# Altium project Power_Board_Schematics_v1.PrjPcb
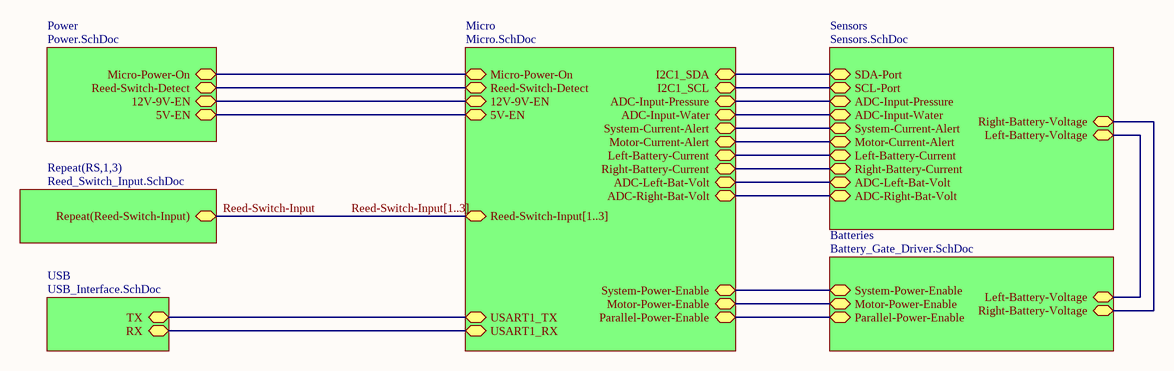
[diagram p0: Power_Board_Schematics_Master.SchDoc]
7 sheets, 217 parts. Net scope: hierarchical (ports join the sheet entries above them; power ports are global).
Board file: Power_Board_PCB.PcbDoc
Sheets:
  Power_Board_Schematics_Master.SchDoc
    Micro = Micro.SchDoc
    Batteries = Battery_Gate_Driver.SchDoc
    Power = Power.SchDoc
    RS1 = Reed_Switch_Input.SchDoc
    RS2 = Reed_Switch_Input.SchDoc
    RS3 = Reed_Switch_Input.SchDoc
    USB = USB_Interface.SchDoc
    Sensors = Sensors.SchDoc

## Sheet Power_Board_Schematics_Master.SchDoc
size A4

### Sub-sheets
Batteries = Battery_Gate_Driver.SchDoc: Motor-Power-Enable, System-Power-Enable, Parallel-Power-Enable, Left-Battery-Voltage, Right-Battery-Voltage
Micro = Micro.SchDoc: Micro-Power-On, Reed-Switch-Detect, Reed-Switch-Input[1..3], Motor-Power-Enable, System-Power-Enable, USART1_RX, USART1_TX, I2C1_SDA, I2C1_SCL, ADC-Input-Pressure, ADC-Input-Water, System-Current-Alert, Motor-Current-Alert, Left-Battery-Current, Right-Battery-Current, 12V-9V-EN, 5V-EN, Parallel-Power-Enable, ADC-Left-Bat-Volt, ADC-Right-Bat-Volt
Power = Power.SchDoc: Micro-Power-On, Reed-Switch-Detect, 12V-9V-EN, 5V-EN
Repeat(RS,1,3) = Reed_Switch_Input.SchDoc: Repeat(Reed-Switch-Input)
Sensors = Sensors.SchDoc: SDA-Port, SCL-Port, ADC-Input-Pressure, ADC-Input-Water, System-Current-Alert, Motor-Current-Alert, Left-Battery-Current, Right-Battery-Current, Left-Battery-Voltage, Right-Battery-Voltage, ADC-Left-Bat-Volt, ADC-Right-Bat-Volt
USB = USB_Interface.SchDoc: TX, RX

### Nets
Reed-Switch-Input: sheet Repeat(RS,1,3)/Repeat(Reed-Switch-Input)
SCL: sheet Micro/I2C1_SCL, sheet Sensors/SCL-Port
SDA: sheet Micro/I2C1_SDA, sheet Sensors/SDA-Port
NetCN8_5: sheet Micro/USART1_TX, sheet USB/TX
NetCN8_6: sheet Micro/USART1_RX, sheet USB/RX
NetQ9_3: sheet Micro/Reed-Switch-Detect, sheet Power/Reed-Switch-Detect
NetR5_1: sheet Micro/System-Current-Alert, sheet Sensors/System-Current-Alert
NetR6_1: sheet Micro/Motor-Current-Alert, sheet Sensors/Motor-Current-Alert
NetR25_2: sheet Micro/Micro-Power-On, sheet Power/Micro-Power-On
NetR52_1: sheet Micro/5V-EN, sheet Power/5V-EN
NetR53_1: sheet Micro/12V-9V-EN, sheet Power/12V-9V-EN
NetR54_2: sheet Batteries/Left-Battery-Voltage, sheet Sensors/Left-Battery-Voltage
NetR55_2: sheet Batteries/Right-Battery-Voltage, sheet Sensors/Right-Battery-Voltage
NetR60_1: sheet Micro/Parallel-Power-Enable, sheet Batteries/Parallel-Power-Enable
NetR61_1: sheet Micro/Motor-Power-Enable, sheet Batteries/Motor-Power-Enable
NetR62_1: sheet Micro/System-Power-Enable, sheet Batteries/System-Power-Enable
NetU3_1: sheet Micro/Right-Battery-Current, sheet Sensors/Right-Battery-Current
NetU3_6: sheet Micro/Left-Battery-Current, sheet Sensors/Left-Battery-Current
NetU3_8: sheet Micro/ADC-Input-Pressure, sheet Sensors/ADC-Input-Pressure
NetU3_13: sheet Micro/ADC-Input-Water, sheet Sensors/ADC-Input-Water
NetU11_16: sheet Micro/ADC-Left-Bat-Volt, sheet Sensors/ADC-Left-Bat-Volt
NetU11_17: sheet Micro/ADC-Right-Bat-Volt, sheet Sensors/ADC-Right-Bat-Volt

### Buses and harness runs
bus Reed-Switch-Input[1..3] = sheet Micro/Reed-Switch-Input[1..3]

## Sheet Micro.SchDoc
size A4
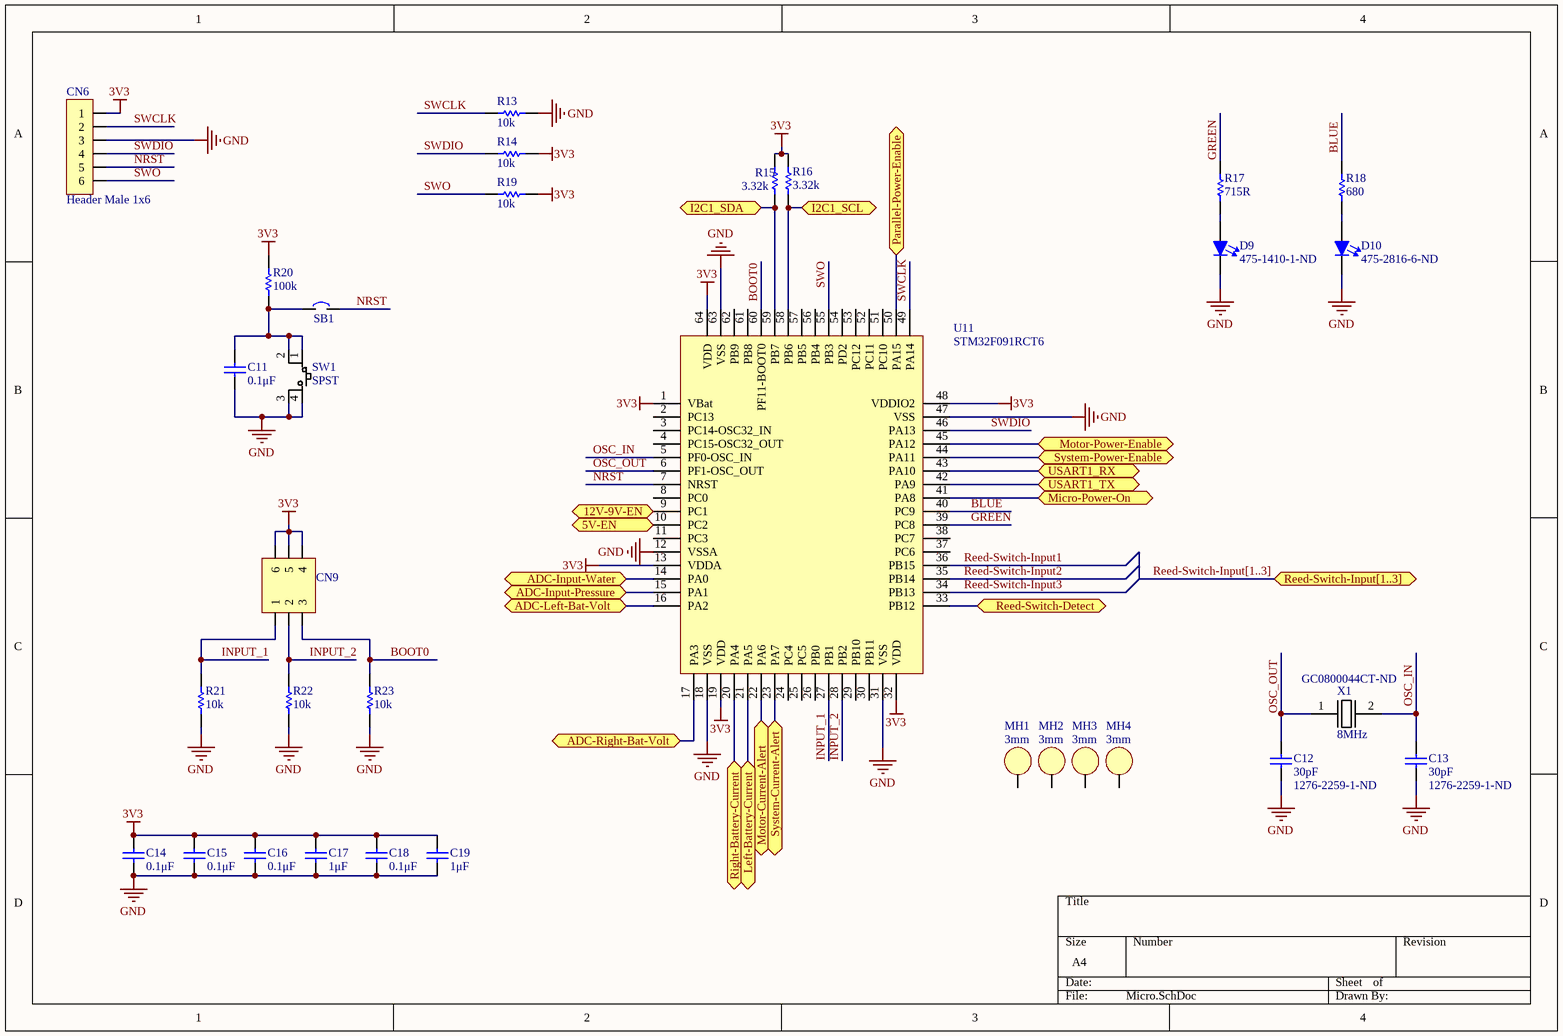
[diagram p1: Micro.SchDoc]

### Parts
C11  0.1μF  [CAPC1608N(0603")]
C12  30pF  Supplier Part Number 1: 1276-2259-1-ND  [CAPC1608N(0603")]
C13  30pF  Supplier Part Number 1: 1276-2259-1-ND  [CAPC1608N(0603")]
C14  0.1μF  [CAPC1608N(0603")]
C15  0.1μF  [CAPC1608N(0603")]
C16  0.1μF  [CAPC1608N(0603")]
C17  1μF  [CAPC1608N(0603")]
C18  0.1μF  [CAPC1608N(0603")]
C19  1μF  [CAPC1608N(0603")]
CN6  Header Male 1x6  [Header, Male, 1X6]
CN9  Header, Male, 2x3, Pitch: 0.1" (2.54mm), THT  [Header, Male, 2x3, Pitch: 0.1" (2.54mm),THT]  (value not drawn)
D9  Supplier Part Number 1: 475-1410-1-ND  [LED0805]  (hidden comment: Red)
D10  Supplier Part Number 1: 475-2816-6-ND  [LED0603]  (hidden comment: Blue)
MH1  3mm  [Mount-Hole_3mm]
MH2  3mm  [Mount-Hole_3mm]
MH3  3mm  [Mount-Hole_3mm]
MH4  3mm  [Mount-Hole_3mm]
R13  10k  [RESC1608N(0603")]
R14  10k  [RESC1608N(0603")]
R15  3.32k  [RESC1608N(0603")]
R16  3.32k  [RESC1608N(0603")]
R17  715R  [RESC1608N(0603")]
R18  680  [RESC2012N(0805")]
R19  10k  [RESC1608N(0603")]
R20  100k  [RESC1608N(0603")]
R21  10k  [RESC1608N(0603")]
R22  10k  [RESC1608N(0603")]
R23  10k  [RESC1608N(0603")]
SB1  Solder Bridge  [Solder Bridge]  (value not drawn)
SW1  SPST  [4-SPST-NO]
U11  STM32F091RCT6  [STM-LQFP64_N]
X1  8MHz  Supplier Part Number 1: GC0800044CT-ND  [HC49/US]

### Ports
5V-EN, 12V-9V-EN, ADC-Input-Pressure, ADC-Input-Water, ADC-Left-Bat-Volt, ADC-Right-Bat-Volt, I2C1_SCL, I2C1_SDA, Left-Battery-Current, Micro-Power-On, Motor-Current-Alert, Motor-Power-Enable, Parallel-Power-Enable, Reed-Switch-Detect, Reed-Switch-Input[1..3], Right-Battery-Current, System-Current-Alert, System-Power-Enable, USART1_RX, USART1_TX

### Nets
3V3: C14.2(Cathode) C15.2(Cathode) C16.2(Cathode) C17.2(Cathode) C18.2(Cathode) C19.2(Cathode) CN6.1 CN9.4 CN9.5 CN9.6 R14.2 R15.1 R16.1 R19.2 R20.2 U11.1(VBat) U11.13(VDDA) U11.19(VDD) U11.32(VDD) U11.48(VDDIO2) U11.64(VDD)
GND: C11.1(Anode) C12.1 C13.1 C14.1(Anode) C15.1(Anode) C16.1(Anode) C17.1(Anode) C18.1(Anode) C19.1(Anode) CN6.3 D9.1(Cathode) D10.1(Cathode) R13.1 R21.1 R22.1 R23.1 SW1.3 SW1.4 U11.12(VSSA) U11.18(VSS) U11.31(VSS) U11.47(VSS) U11.63(VSS)
BLUE: R18.2 U11.40(PC9)
BOOT0: CN9.3 R23.2 U11.60(PF11-BOOT0)
GREEN: R17.2 U11.39(PC8)
INPUT_1: CN9.1 R21.2 U11.27(PB1)
INPUT_2: CN9.2 R22.2 U11.28(PB2)
NRST: CN6.5 SB1.2 U11.7(NRST)
OSC_IN: C13.2 U11.5(PF0-OSC_IN) X1.2
OSC_OUT: C12.2 U11.6(PF1-OSC_OUT) X1.1
Reed-Switch-Input1: U11.36(PB15)
Reed-Switch-Input2: U11.35(PB14)
Reed-Switch-Input3: U11.34(PB13)
SCL: R16.2 U11.58(PB6) ; port I2C1_SCL
SDA: R15.2 U11.59(PB7) ; port I2C1_SDA
SWCLK: CN6.2 R13.2 U11.49(PA14)
SWDIO: CN6.4 R14.1 U11.46(PA13)
SWO: CN6.6 R19.1 U11.55(PB3)
NetC11_2: C11.2(Cathode) R20.1 SB1.1 SW1.1 SW1.2
NetCN8_5: U11.42(PA9) ; port USART1_TX
NetCN8_6: U11.43(PA10) ; port USART1_RX
NetD9_2: D9.2(Anode) R17.1
NetD10_2: D10.2(Anode) R18.1
NetQ9_3: U11.33(PB12) ; port Reed-Switch-Detect
NetR5_1: U11.23(PA7) ; port System-Current-Alert
NetR6_1: U11.22(PA6) ; port Motor-Current-Alert
NetR25_2: U11.41(PA8) ; port Micro-Power-On
NetR52_1: U11.10(PC2) ; port 5V-EN
NetR53_1: U11.9(PC1) ; port 12V-9V-EN
NetR60_1: U11.50(PA15) ; port Parallel-Power-Enable
NetR61_1: U11.45(PA12) ; port Motor-Power-Enable
NetR62_1: U11.44(PA11) ; port System-Power-Enable
NetU3_1: U11.20(PA4) ; port Right-Battery-Current
NetU3_6: U11.21(PA5) ; port Left-Battery-Current
NetU3_8: U11.15(PA1) ; port ADC-Input-Pressure
NetU3_13: U11.14(PA0) ; port ADC-Input-Water
NetU11_16: U11.16(PA2) ; port ADC-Left-Bat-Volt
NetU11_17: U11.17(PA3) ; port ADC-Right-Bat-Volt

Not connected (* = marked no-connect by the designer): MH1 1; MH2 1; MH3 1; MH4 1; U11 2(PC13) 3(PC14-OSC32_IN) 4(PC15-OSC32_OUT) 8(PC0) 11(PC3) 24(PC4) 25(PC5) 26(PB0) 29(PB10) 30(PB11) 37(PC6) 38(PC7) 51(PC10) 52(PC11) 53(PC12) 54(PD2) 56(PB4) 57(PB5) 61(PB8) 62(PB9)

### Buses and harness runs
bus Reed-Switch-Input[1..3] = port Reed-Switch-Input[1..3]

### Library data of the parts
C11 C14-C16 C18 = 0.1uF 100V 0603 SMD, Ceramic: Capacitor, Ceramic, 100V, +/- 10%, 0603 SMD, X7R; MFG: TDK; MFG#: CGA3E3X7S2A104K080AB; Published: 16-04-26; Publisher: AUVic; PackageDescription: Chip Capacitor; Value: 0.1μF; Created By: Ashwin Sira; Supplier 1: Digi-Key; Supplier Part Number 1: 445-6938-1-ND
C12 C13 = 30pF 50V 0603 SMD, Ceramic: Capacitor, Ceramic, 50V, +/-1%, 0603 SMD, C0G; Made By: Andy Bates; Published: 16-09-12; Publisher: AUVic; PackageDescription: Chip Capacitor; Value: 30pF; Supplier 1: Digi-Key
C17 C19 = 1uF 25V 0603 SMD, Ceramic: Capacitor, Ceramic, 25V, +/- 10%, 0603 SMD, X5R; MFG: Murata-Electronics-North-America; MFG#: GRM188R61E105KA12D; Published: 16-06-27; Publisher: AUVic; PackageDescription: Chip Capacitor; Value: 1μF; Created By: Andy Bates; Supplier 1: Digi-Key; Supplier Part Number 1: 490-3897-1-ND
CN6 = Header, Male, 1x6: 1x6, Pads Pitch: 0.1" (2.54mm), Through hole; Made Bates: Andy Bates; Supplier 1: Digikey; Supplier 1 Part Number: 952-2270-ND
D9 = LED, 0805 (2012), Green, Clear: Colour: Red; Created By: Andy Bates; Supplier 1: Digi-Key
D10 = LED, 0603 (1608), Blue, Clear: Colour: Blue; Created By: Lyden Smith; Date Created: 2017-09-19; Supplier 1: Digi-Key
MH1-MH4 = Mount_Hole_3mm
R13 R14 R19 R21-R23 = 10kR, 1%, 1/10W, 0603 SMD: Made By: Ashwin Sira; Owned By: AUVic; Created On: 14-05-31; Last Edited: 14-05-31; Supplier 1: Digi-Key; Supplier Part Number 1: 311-10.0KHRCT-ND; Value: 10k
R15 R16 = 3.32k, 1%, 1/10W, 0603, SMD: Created By: Ashwin Sira; Publisher: AUVic; Date Created: 2016-06-25; Value: 3.32k; Supplier 1: Digi-Key; Supplier Part Number 1: RMCF0603FT3K32CT-ND
R17 = 715R, 1%, 1/10W, 0603, SMD: Created By: Ashwin Sira; Publisher: AUVic; Date Created: 2016-06-10; Value: 715R; Supplier 1: Digi-Key; Supplier Part Number 1: 541-715HCT-ND
R18 = 680, 5%, 1/8W, 0805 SMD: Value: 680; Created By: Lyden Smith; Created On: 2017-06-04; Supplier 1: Digi-Key; Supplier Part Number 1: RMCF0805JT680RCT-ND
R20 = 100kR, 1%, 1/10W, 0603 SMD: Made By: Andy Bates; Owned By: AUVic; Created On: 14-06-30; Last Edited: 14-06-30; Value: 100k; Supplier 1: Digi-Key; Supplier Part Number 1: 311-100KGRCT-ND
SB1 = Solder Bridge: Made By: Andy Bates; Created On: 2016/09/08
SW1 = 4 pin Tacitle Switch: Made By: Andy Bates; Button Type: Single Pole Single Throw; Supplier 1: Digikey; Supplier 1 Part Number: CKN9084CT-ND
U11 = STM32F091RCT6: Made By: Andy Bates; Supplier 1: Digikey; Supplier 1 Part Number: 497-15167-ND
X1 = Oscillator 8MHz 40ESR: 8Mhz 40ESR  16pF -20°C ~ 70°C; Made By: Lyden Smith; Date Made: 2017-09-18; Supplier 1: Digi-Key
CN9 = Header, Male, 2x3, Pitch: 0.1" (2.54mm), THT: Publisher: AUVic; Date Published: 2017-09-13; Last Updated: *; Reviewed By: *; Created By: Andy Bates

## Sheet Battery_Gate_Driver.SchDoc
size A4
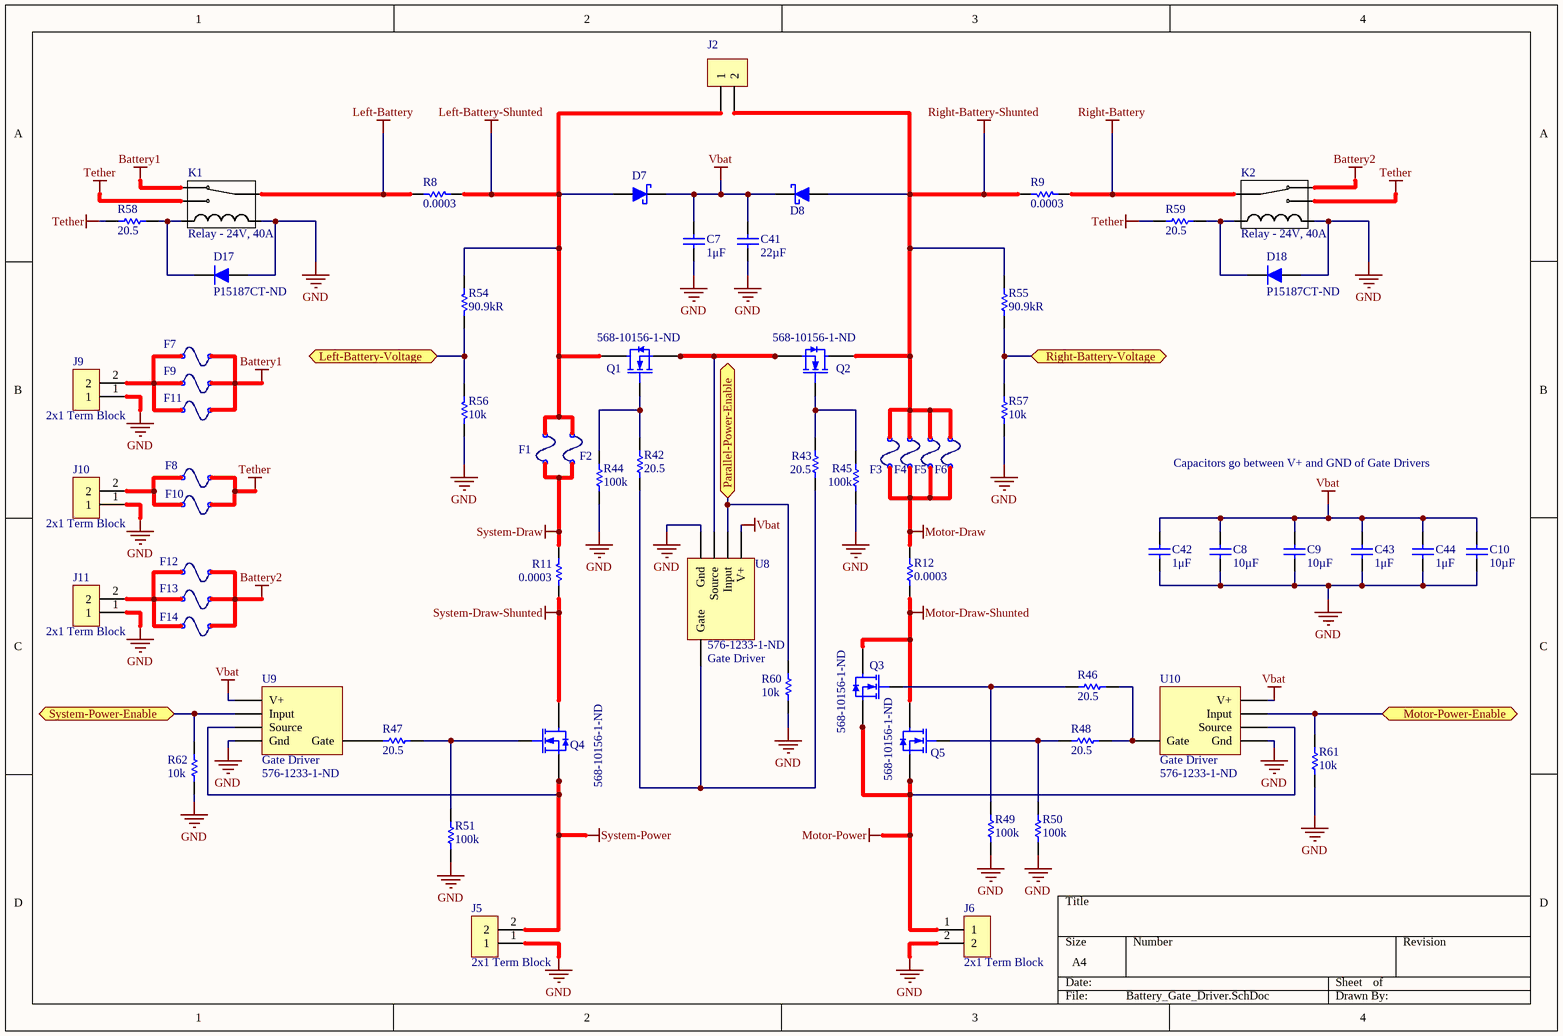
[diagram p2: Battery_Gate_Driver.SchDoc]

### Parts
C7  1μF  [CAPC1608N(0603")]
C8  10µF  [CAPC3216N(1206")]
C9  10µF  [CAPC3216N(1206")]
C10  10µF  [CAPC3216N(1206")]
C41  22µF  [CAPC2012N(0805")]
C42  1μF  [CAPC1608N(0603")]
C43  1μF  [CAPC1608N(0603")]
C44  1μF  [CAPC1608N(0603")]
D7  CUS08F30H3FCT-ND  [SC-76]  (value not drawn)
D8  CUS08F30H3FCT-ND  [SC-76]  (value not drawn)
D17  Supplier Part Number 1: P15187CT-ND  [SODFL535X110-2N]  (hidden comment: DA2S10400L, SOD323F / SC-90)  (no BOM)
D18  Supplier Part Number 1: P15187CT-ND  [SODFL535X110-2N]  (hidden comment: DA2S10400L, SOD323F / SC-90)  (no BOM)
F1  MINI  [MINI BLADE FUSEHOLDER]  (value not drawn)
F2  MINI  [MINI BLADE FUSEHOLDER]  (value not drawn)
F3  MINI  [MINI BLADE FUSEHOLDER]  (value not drawn)
F4  MINI  [MINI BLADE FUSEHOLDER]  (value not drawn)
F5  MINI  [MINI BLADE FUSEHOLDER]  (value not drawn)
F6  MINI  [MINI BLADE FUSEHOLDER]  (value not drawn)
F7  MINI  [MINI BLADE FUSEHOLDER]  (value not drawn)
F8  MINI  [MINI BLADE FUSEHOLDER]  (value not drawn)
F9  MINI  [MINI BLADE FUSEHOLDER]  (value not drawn)
F10  MINI  [MINI BLADE FUSEHOLDER]  (value not drawn)
F11  MINI  [MINI BLADE FUSEHOLDER]  (value not drawn)
F12  MINI  [MINI BLADE FUSEHOLDER]  (value not drawn)
F13  MINI  [MINI BLADE FUSEHOLDER]  (value not drawn)
F14  MINI  [MINI BLADE FUSEHOLDER]  (value not drawn)
J2  12AWG Wire Bridge  [12AWG Wire Bridge]  (value not drawn)
J5  2x1 Term Block  [2x1 Terminal Blocks EM2929]
J6  2x1 Term Block  [2x1 Terminal Blocks EM2929]
J9  2x1 Term Block  [2x1 Terminal Blocks EM2929]
J10  2x1 Term Block  [2x1 Terminal Blocks EM2929]
J11  2x1 Term Block  [2x1 Terminal Blocks EM2929]
K1  Relay - 24V, 40A  [1432871-1 Relay Footprint]
K2  Relay - 24V, 40A  [1432871-1 Relay Footprint]
Q1  Supplier Part Number 1: 568-10156-1-ND  [LFPAK-PowerSO8]  (hidden comment: MOSFET N-Channel, 40V, 100A, 272W)
Q2  Supplier Part Number 1: 568-10156-1-ND  [LFPAK-PowerSO8]  (hidden comment: MOSFET N-Channel, 40V, 100A, 272W)
Q3  Supplier Part Number 1: 568-10156-1-ND  [LFPAK-PowerSO8]  (hidden comment: MOSFET N-Channel, 40V, 100A, 272W)
Q4  Supplier Part Number 1: 568-10156-1-ND  [LFPAK-PowerSO8]  (hidden comment: MOSFET N-Channel, 40V, 100A, 272W)
Q5  Supplier Part Number 1: 568-10156-1-ND  [LFPAK-PowerSO8]  (hidden comment: MOSFET N-Channel, 40V, 100A, 272W)
R8  0.0003  [RESC6332N(2512")]
R9  0.0003  [RESC6332N(2512")]
R11  0.0003  [RESC6332N(2512")]
R12  0.0003  [RESC6332N(2512")]
R42  20.5  [RESC1608N(0603")]
R43  20.5  [RESC1608N(0603")]
R44  100k  [RESC2012N(0805")]
R45  100k  [RESC2012N(0805")]
R46  20.5  [RESC1608N(0603")]
R47  20.5  [RESC1608N(0603")]
R48  20.5  [RESC1608N(0603")]
R49  100k  [RESC2012N(0805")]
R50  100k  [RESC2012N(0805")]
R51  100k  [RESC2012N(0805")]
R54  90.9kR  [RESC1608N(0603")]
R55  90.9kR  [RESC1608N(0603")]
R56  10k  [RESC1608N(0603")]
R57  10k  [RESC1608N(0603")]
R58  20.5  [RESC1608N(0603")]
R59  20.5  [RESC1608N(0603")]
R60  10k  [RESC1608N(0603")]
R61  10k  [RESC1608N(0603")]
R62  10k  [RESC1608N(0603")]
U8  Gate Driver  Supplier Part Number 1: 576-1233-1-ND  [SOC 8]
U9  Gate Driver  Supplier Part Number 1: 576-1233-1-ND  [SOC 8]
U10  Gate Driver  Supplier Part Number 1: 576-1233-1-ND  [SOC 8]

### Ports
Left-Battery-Voltage, Motor-Power-Enable, Parallel-Power-Enable, Right-Battery-Voltage, System-Power-Enable

### Nets
Battery1: F7.2 F9.2 F11.2 K1.87a
Battery2: F12.2 F13.2 F14.2 K2.87a
GND: C7.1(Anode) C8.1(Anode) C9.1(Anode) C10.1(Anode) C41.1(Anode) C42.1(Anode) C43.1(Anode) C44.1(Anode) D17.1(Anode) D18.1(Anode) J5.1 J6.2 J9.1 J10.1 J11.1 K1.85 K2.86 R44.1 R45.1 R49.1 R50.1 R51.1 R56.2 R57.2 R60.2 R61.2 R62.2 U8.4(Gnd) U9.4(Gnd) U10.4(Gnd)
Left-Battery: K1.30 R8.2
Left-Battery-Shunted: D7.A(Anode) F1.2 F2.2 J2.1 Q1.5(Drain) R8.1 R54.1
Motor-Draw: F3.1 F4.1 F5.1 F6.1 R12.1
Motor-Draw-Shunted: Q3.5(Drain) Q5.5(Drain) R12.2
Motor-Power: J6.1 Q3.1(Source) Q3.2(Source) Q3.3(Source) Q5.1(Source) Q5.2(Source) Q5.3(Source) U10.3(Source)
Right-Battery: K2.30 R9.1
Right-Battery-Shunted: D8.A(Anode) F3.2 F4.2 F5.2 F6.2 J2.2 Q2.5(Drain) R9.2 R55.1
System-Draw: F1.1 F2.1 R11.2
System-Draw-Shunted: Q4.5(Drain) R11.1
System-Power: J5.2 Q4.1(Source) Q4.2(Source) Q4.3(Source) U9.3(Source)
Tether: F8.2 F10.2 K1.87 K2.87 R58.1 R59.1
Vbat: C7.2(Cathode) C8.2(Cathode) C9.2(Cathode) C10.2(Cathode) C41.2(Cathode) C42.2(Cathode) C43.2(Cathode) C44.2(Cathode) D7.K(Cathode) D8.K(Cathode) U8.1(V+) U9.1(V+) U10.1(V+)
NetD17_2: D17.2(Cathode) K1.86 R58.2
NetD18_2: D18.2(Cathode) K2.85 R59.2
NetF7_1: F7.1 F9.1 F11.1 J9.2
NetF8_1: F8.1 F10.1 J10.2
NetF12_1: F12.1 F13.1 F14.1 J11.2
NetQ1_1: Q1.1(Source) Q1.2(Source) Q1.3(Source) Q2.1(Source) Q2.2(Source) Q2.3(Source) U8.3(Source)
NetQ1_4: Q1.4(Gate) R42.2 R44.2
NetQ2_4: Q2.4(Gate) R43.2 R45.2
NetQ3_4: Q3.4(Gate) R46.2 R49.2
NetQ4_4: Q4.4(Gate) R47.1 R51.2
NetQ5_4: Q5.4(Gate) R48.2 R50.2
NetR42_1: R42.1 R43.1 U8.5(Gate)
NetR46_1: R46.1 R48.1 U10.5(Gate)
NetR47_2: R47.2 U9.5(Gate)
NetR54_2: R54.2 R56.1 ; port Left-Battery-Voltage
NetR55_2: R55.2 R57.1 ; port Right-Battery-Voltage
NetR60_1: R60.1 U8.2(Input) ; port Parallel-Power-Enable
NetR61_1: R61.1 U10.2(Input) ; port Motor-Power-Enable
NetR62_1: R62.1 U9.2(Input) ; port System-Power-Enable

### Notes on the sheet
- Capacitors go between V+ and GND of Gate Drivers

### Library data of the parts
C7 C42-C44 = 1uF 50V 0603 SMD, Ceramic: Capacitor, Ceramic, 50V, +/- 10%, 0603 SMD, X5R; PackageDescription: Chip Capacitor; Value: 1μF; Created By: Lyden Smith; Date Created: 2017-10-26; Supplier 1: Digi-Key; Supplier Part Number 1: 1276-1860-6-ND
C8-C10 = 10uF 50V 1206 SMD, Ceramic: Capacitor, Ceramic, 50V, +/- 10%, 1206 SMD, X5R; Published: 14-06-01; Publisher: AUVic; PackageDescription: Chip Capacitor; Value: 10µF; Supplier 1: Digi-Key; Supplier Part Number 1: 1276-2876-1-ND
C41 = 22uF 35V 0805 SMD, Ceramic: Capacitor, Ceramic, 35V, +/- 20%, 0805 SMD, X5R; Published: 14-06-01; Publisher: AUVic; PackageDescription: Chip Capacitor; Value: 22µF; Supplier 1: Digi-Key; Supplier Part Number 1: 445-14428-1-ND
D7 D8 = CUS08F30H3FCT-ND: Diode, Schottky, 30V, 800mA; Created By: Andy Bates; Publisher: AUVic; Date Created: 2016-09-09; Supplier 1: Digi-Key; Supplier Part Number 1: CUS08F30H3FCT-ND
D17 D18 = DA2S10400L, SOD323F / SC-90: Forward Voltage Drop: 1.1V; Created By: Andy Bates; Publisher: AUVic; Date Created: 2016-09-08; Supplier 1: Digi-Key
F1-F14 = MINI, ATC, ATO, etc. Blade Fuse: Blade Fuse Holder, 30A; Created By: Lyden Smith; Date Created: 2018-01-11; Supplier 1: Digi-Key; Supplier Part Number 1: 36-3557-2-ND; Type: MINI
J5 J6 J9-J11 = 2x1 Terminal Block, 65A, 6-20AWG: Made by: Lyden Smith; Supplier 1: Digi-Key; Supplier Part Number 1: 283-4339-ND; Date Made: 2017-11-13
K1 K2 = Relay, 1 Form C, SPDT, 24V, 40A: Supplier 1: Digi-Key; Supplier Part Number 1: PB1042-ND
Q1-Q5 = MOSFET N-Channel, 40V, 100A, 272W: MOSFET N-Channel, 40V, 100A, 272W, Enh-Mode; MFG: NXP Semiconductors; MFG#: PSMN1R8-40YLC,115; Reviewed_By: Ashwin Sira; Latest_Revision_Note: Attached footprint; Created By: Ashwin Sira; Publisher: AUVic; Reviewed_Date: 2016_04_26; Latest_Revision_By: Ashwin Sira; Latest_Revision_Date: 2016_04_26; Supplier 1: Digi-Key
R8 R9 R11 R12 = 0.0003R, 1%, 3W, 2512 SMD: Made By: Ashwin Sira; Owned By: AUVic; Created On: 14-05-31; Last Edited: 14-05-31; Value: 0.0003; Supplier 1: Digi-Key
R42 R43 R46-R48 R58 R59 = 20.5 Ohm, 1%, 1/10W , 0603, SMD: Created By: Gabriel Green; Publisher: AUVic; Date Created: 2017-06-23; Value: 20.5; Supplier 1: Digi-Key; Supplier Part Number 1: P20.5HCT-ND
R44 R45 R49-R51 = 100kR, 1%, 1/4W, 0805 SMD: Made By: Ashwin Sira; Owned By: AUVic; Created On: 14-05-31; Last Edited: 14-05-31; Value: 100k; Supplier 1: Digi-Key; Supplier Part Number 1: 311-1.00MCRCT-ND
R54 R55 = 90.9k, 1%, 1/10W, 0603, SMD: Created By: Andy Bates; Publisher: AUVic; Date Created: 2017-06-06; Value: 90.9kR; Supplier 1: Digikey; Supplier Part Number 1: 311-90.9KHRDKR-ND
R56 R57 R60-R62 = 10kR, 1%, 1/10W, 0603 SMD: Made By: Ashwin Sira; Owned By: AUVic; Created On: 14-05-31; Last Edited: 14-05-31; Supplier 1: Digi-Key; Supplier Part Number 1: 311-10.0KHRCT-ND; Value: 10k
U8-U10 = Gate Driver TTL Logic 3 - 30V: Supplier 1: Digi-Key
J2 = 12AWG Wire Bridge: Created By: Lyden Smith; Created On: 2018-01-29

## Sheet Power.SchDoc
size A4
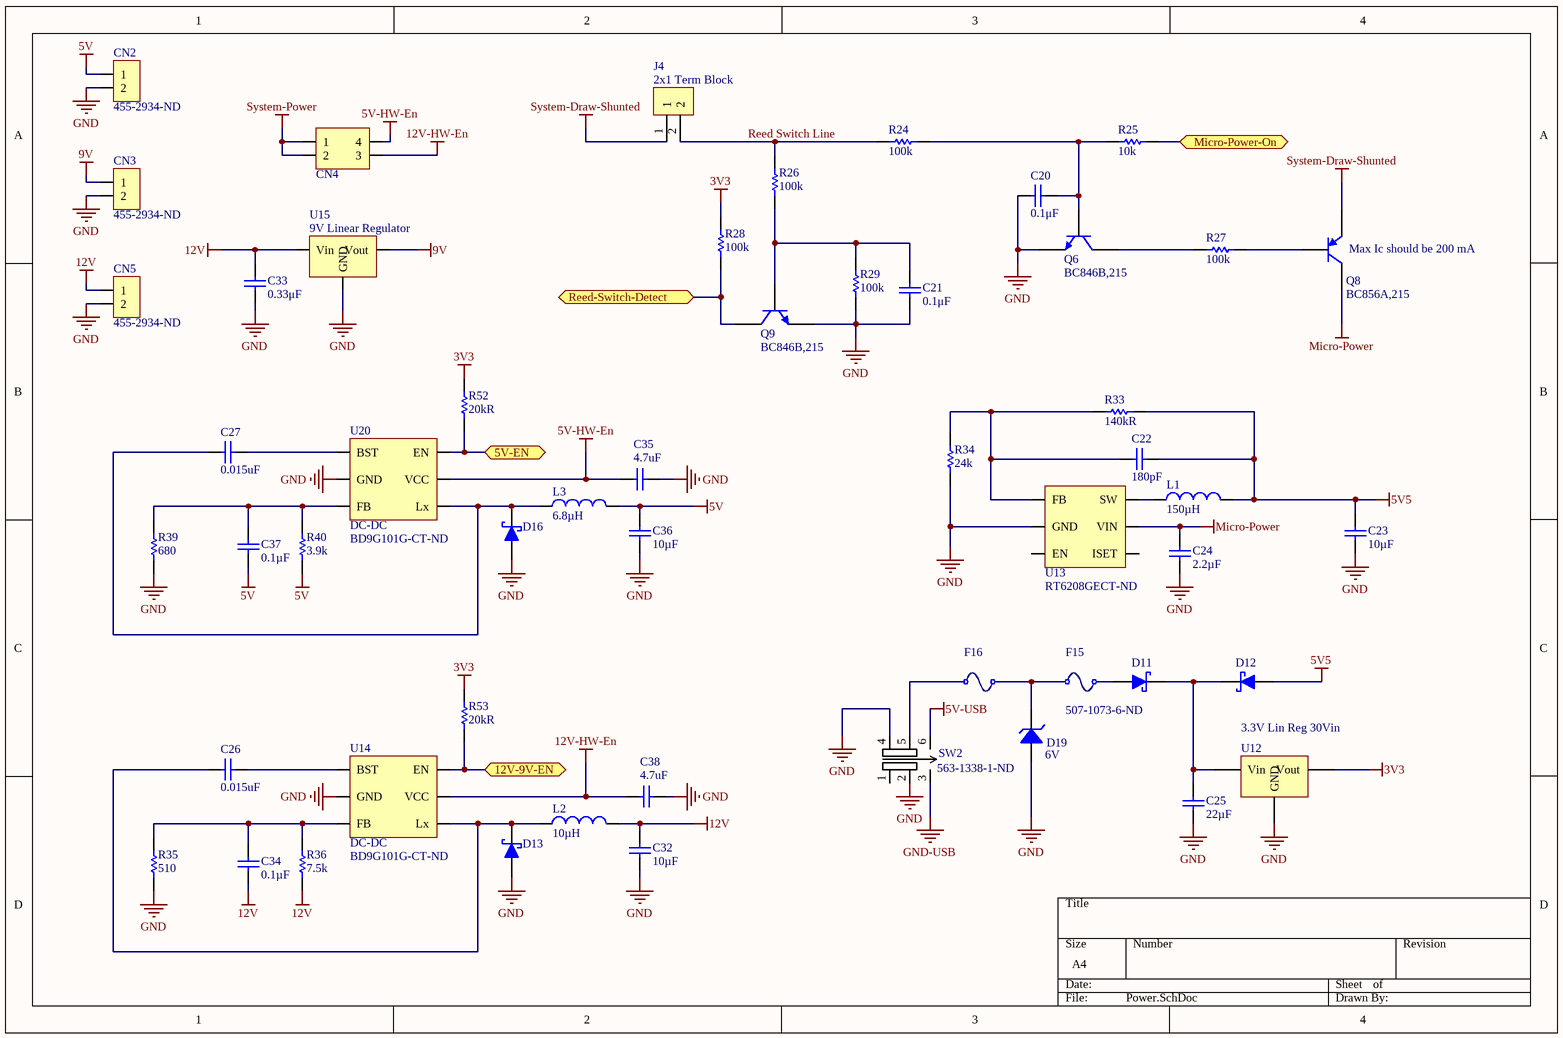
[diagram p3: Power.SchDoc]

### Parts
C20  0.1μF  [CAPC1608N(0603")]
C21  0.1μF  [CAPC1608N(0603")]
C22  180pF  [CAPC1608N(0603")]
C23  10µF  [CAPC2012N(0805")]
C24  2.2µF  [CAPC1608N(0603")]
C25  22µF  [CAPC2012N(0805")]
C26  0.015uF  [CAPC1608N(0603")]
C27  0.015uF  [CAPC1608N(0603")]
C32  10µF  [CAPC3216N(1206")]
C33  0.33μF  [CAPC1608N(0603")]
C34  Capacitance: 0.1µF  [CAPC1608N(0603")]  (hidden comment: 0.1uF, 50V, 10%, X7R, 1608)
C35  4.7uF  [CAPC3216N(1206")]
C36  10µF  [CAPC2012N(0805")]
C37  Capacitance: 0.1µF  [CAPC1608N(0603")]  (hidden comment: 0.1uF, 50V, 10%, X7R, 1608)
C38  4.7uF  [CAPC3216N(1206")]
CN2  Supplier Part Number 1: 455-2934-ND  [Male JST B2B-EH-A]  (hidden comment: 1x2, JST B2B-EH-A, Pads Pitch: 0.098" (2.50mm), Through Hole)  (no BOM)
CN3  Supplier Part Number 1: 455-2934-ND  [Male JST B2B-EH-A]  (hidden comment: 1x2, JST B2B-EH-A, Pads Pitch: 0.098" (2.50mm), Through Hole)  (no BOM)
CN4  Header, Male, 2x2, Pitch: 0.1" (2.54mm), THT  [Header, Male, 2x2, Pitch: 0.1" (2.54mm),THT]  (value not drawn)
CN5  Supplier Part Number 1: 455-2934-ND  [Male JST B2B-EH-A]  (hidden comment: 1x2, JST B2B-EH-A, Pads Pitch: 0.098" (2.50mm), Through Hole)  (no BOM)
D11  CUS08F30H3FCT-ND  [SC-76]  (value not drawn)
D12  CUS08F30H3FCT-ND  [SC-76]  (value not drawn)
D13  RB060M-60TR  [SOD-123]  (value not drawn)
D16  RB060M-60TR  [SOD-123]  (value not drawn)
D19  6V  [DO-214AA]
F15  Supplier Part Number 1: 507-1073-6-ND  [1206 SMD]  (hidden comment: SMD)
F16  SMD  [1206 SMD]  (value not drawn)
J4  2x1 Term Block  [2X1 Terminal Blocks]
L1  150µH  [CB - 1007 (2518)]
L2  10µH  [NR4018T6R8M Inductor]
L3  6.8µH  [NR4018T6R8M Inductor]
Q6  BC846B,215  [SOT-23]
Q8  BC856A,215  [SOT-23]
Q9  BC846B,215  [SOT-23]
R24  100k  [RESC1608N(0603")]
R25  10k  [RESC1608N(0603")]
R26  100k  [RESC1608N(0603")]
R27  100k  [RESC1608N(0603")]
R28  100k  [RESC1608N(0603")]
R29  100k  [RESC1608N(0603")]
R33  140kR  [RESC1005N(0402")]
R34  24k  [RESC2012N(0805")]
R35  510  [RESC2012N(0805")]
R36  7.5k  [RESC2012N(0805")]
R39  680  [RESC2012N(0805")]
R40  3.9k  [RESC2012N(0805")]
R52  20kR  [RESC1608N(0603")]
R53  20kR  [RESC1608N(0603")]
SW2  Supplier Part Number 1: 563-1338-1-ND  [CL-2B-22A]  (hidden comment: *)
U12  3.3V Lin Reg 30Vin  [T0-252]
U13  Supplier Part Number 1: RT6208GECT-ND  [SOT23-6_L]  (hidden comment: RT6208GE)
U14  DC-DC  Supplier Part Number 1: BD9G101G-CT-ND  [SOT23-6_L]
U15  9V Linear Regulator  [DPAK229P991X238-3N]
U20  DC-DC  Supplier Part Number 1: BD9G101G-CT-ND  [SOT23-6_L]

### Ports
5V-EN, 12V-9V-EN, Micro-Power-On, Reed-Switch-Detect

### Nets
3V3: R28.2 R52.2 R53.2 U12.3(Vout)
5V: C36.2(Cathode) C37.1(Anode) CN2.1 L3.2 R40.1
5V5: C22.2 C23.2(Cathode) D12.A(Anode) L1.2 R33.2
5V-HW-En: C35.2 CN4.4 U20.5(VCC)
5V-USB: SW2.6
9V: CN3.1 U15.3(Vout)
12V: C32.2(Cathode) C33.2(Cathode) C34.1(Anode) CN5.1 L2.2 R36.1 U15.1(Vin)
12V-HW-En: C38.2 CN4.3 U14.5(VCC)
GND: C20.1(Anode) C21.1(Anode) C23.1(Anode) C24.1(Anode) C25.1(Anode) C32.1(Anode) C33.1(Anode) C35.1 C36.1(Anode) C38.1 CN2.2 CN3.2 CN5.2 D13.A(Anode) D16.A(Anode) D19.A(Anode) Q6.2(E) Q9.2(E) R29.1 R34.1 R35.1 R39.1 SW2.2 SW2.4 U12.1(GND) U13.2(GND) U14.2(GND) U15.4(GND) U20.2(GND)
GND-USB: SW2.3
Micro-Power: C24.2(Cathode) Q8.3(C) U13.5(VIN)
System-Draw-Shunted: J4.1 Q8.2(E)
System-Power: CN4.1 CN4.2
Reed Switch Line: J4.2 R24.2 R26.2
NetC20_2: C20.2(Cathode) Q6.1(B) R24.1 R25.1
NetC21_2: C21.2(Cathode) Q9.1(B) R26.1 R29.2
NetC22_1: C22.1 R33.1 R34.2 U13.1(FB)
NetC25_2: C25.2(Cathode) D11.K(Cathode) D12.K(Cathode) U12.2(Vin)
NetC26_1: C26.1 D13.K(Cathode) L2.1 U14.6(Lx)
NetC26_2: C26.2 U14.1(BST)
NetC27_1: C27.1 D16.K(Cathode) L3.1 U20.6(Lx)
NetC27_2: C27.2 U20.1(BST)
NetC34_2: C34.2(Cathode) R35.2 R36.2 U14.3(FB)
NetC37_2: C37.2(Cathode) R39.2 R40.2 U20.3(FB)
NetD11_A: D11.A(Anode) F15.2
NetD19_K: D19.K(Cathode) F15.1 F16.2
NetF16_1: F16.1 SW2.5
NetL1_1: L1.1 U13.6(SW)
NetQ6_3: Q6.3(C) R27.1
NetQ8_1: Q8.1(B) R27.2
NetQ9_3: Q9.3(C) R28.1 ; port Reed-Switch-Detect
NetR25_2: R25.2 ; port Micro-Power-On
NetR52_1: R52.1 U20.4(EN) ; port 5V-EN
NetR53_1: R53.1 U14.4(EN) ; port 12V-9V-EN

Not connected (* = marked no-connect by the designer): SW2 1; U13 3(EN) 4(ISET)

### Notes on the sheet
- (near Q8) Max Ic should be 200 mA

### Library data of the parts
C20 C21 = 0.1uF 100V 0603 SMD, Ceramic: as C11 on sheet Micro; Published: 16-04-26; Publisher: AUVic; PackageDescription: Chip Capacitor; Value: 0.1μF; Created By: Ashwin Sira; Supplier 1: Digi-Key; Supplier Part Number 1: 445-6938-1-ND
C22 = 180pF 50V 0603 SMD, Ceramic: Capacitor, Ceramic, 50V, +/-5%, 0603 SMD, NP0; Date Created: 2017-09-22; Created By: Lyden Smith; PackageDescription: Chip Capacitor; Value: 180pF; Supplier 1: Digi-Key; Supplier Part Number 1: 1276-1255-1-ND
C23 C36 = 10uF 10V 0805 SMD, Ceramic: Capacitor, Ceramic, 10V, +/- 10%, 0805 SMD, X5R; Made By: Andy Bates; Published: 14-06-23; Publisher: AUVic; PackageDescription: Chip Capacitor; Value: 10µF; Supplier 1: Digi-Key; Supplier Part Number 1: 490-4735-1-ND
C24 = 2.2uF, 50V, 0603 SMD, X5R, Ceramic: Capacitor, Ceramic, 50V, 10%, 0603 SMD, X5R; Date Created: *; PackageDescription: Chip Capacitor; Value: 2.2µF; Made By: *; Publisher: AUVic; Supplier 1: Digi-Key; Supplier Part Number 1: 490-10733-1-ND
C25 = 22uF 35V 0805 SMD, Ceramic: as C41 on sheet Battery_Gate_Driver; Published: 14-06-01; Publisher: AUVic; PackageDescription: Chip Capacitor; Value: 22µF; Supplier 1: Digi-Key; Supplier Part Number 1: 445-14428-1-ND
C26 C27 = 0.015uF 50V 0603 SMD, Ceramic: Capacitor, Ceramic, 50V, +/-10%, 0603 SMD, X7R; Value: 0.015uF; Created By: Lyden Smith; Created On: 2017-06-04; Supplier 1: Digi-Key; Supplier Part Number 1: 1276-1277-1-ND
C32 = 10uF 50V 1206 SMD, Ceramic: as C8 on sheet Battery_Gate_Driver; Published: 14-06-01; Publisher: AUVic; PackageDescription: Chip Capacitor; Value: 10µF; Supplier 1: Digi-Key; Supplier Part Number 1: 1276-2876-1-ND
C33 = 0.33uF 50V 0603 SMD, Ceramic: Capacitor, Ceramic, 50V, +/- 10%, 0603 SMD, X5R; MFG: TDK; MFG#: C1608X5R1H334K080AB; Published: 16-06-29; Publisher: AUVic; PackageDescription: Chip Capacitor; Value: 0.33μF; Created By: Andy Bates; Supplier 1: Digi-Key; Supplier Part Number 1: 445-7462-1-ND
C34 C37 = 0.1uF, 50V, 10%, X7R, 1608: CAP CER 0.1UF 50V 10% X7R 1608 (0603); Manufacturer: Samsung Electro-Mechanics America, Inc; Manufacturer Part Number: CL10B104KB8SFNC; Supplier 1: Digi-Key; RoHS: RoHS Compliant; Category: Capacitors; Stock 1: 743572; Pricing 1: 1=0.12, 10=0.033, 25=0.0232, 100=0.0152, 500=0.01064, 1000=0.00829 (CAD); Packaging: Cut Tape (CT); Tolerance: ±10%; Voltage - Rated: 50V; Temperature Coefficient: X7R; Mounting Type: Surface Mount, MLCC; Operating Temperature: -55°C ~ 125°C; Applications: Boardflex Sensitive; Ratings: -; Package / Case: 0603 (1608 Metric); Size / Dimension: 0.063" L x 0.031" W (1.60mm x 0.80mm); Height - Seated (Max): -; Thickness (Max): 0.035" (0.90mm); Lead Spacing: -; Features: Soft Termination; Lead Style: -; ComponentLink1URL: http://www.samsungsem.com/servlet/FileDownload?type=spec&file=CL10B104KB8SFNC.pdf; ComponentLink1Description: http://www.samsungsem.com/servlet/FileDownload?type=spec&file=CL10B104KB8SFNC.pdf; Supplier Part Number 1: 1276-1936-1-ND
C35 C38 = 4.7uF 50V 1206 SMD, Ceramic: Capacitor, Ceramic, 50V, +/- 10%, 1206 SMD, X7R; Value: 4.7uF; Created By: Lyden Smith; Created On: 2017-06-04; Supplier 1: Digi-Key; Supplier Part Number 1: 587-2994-1-ND
D11 D12 = CUS08F30H3FCT-ND: Diode, Schottky, 30V, 800mA; Created By: Andy Bates; Publisher: AUVic; Date Created: 2016-09-09; Supplier 1: Digi-Key; Supplier Part Number 1: CUS08F30H3FCT-ND
D13 D16 = RB060M-60TR: Diode, Schottky, 60V, 2A; Supplier 1: Digi-Key; Created By: Lyden Smith; Date Created: 2017-06-02; Supplier Part Number 1: RB060M-60CT-ND
D19 = SMBJ5340B-TPMSCT-ND: DIODE ZENER 6V 5W DO214AA; Created On: 2018-01-25; Created By: Lyden Smith; Supplier 1: Digi-Key; Supplier Part Number 1: SMBJ5340B-TPMSDKR-ND; Zener Voltage: 6V
F15 F16 = SMD Fuse, 250mA, 63V, 1206: Created By: Lyden Smith; Date Created: 2018-02-05; Type: SMD; Supplier 1: Digi-Key
  F16: Supplier Part Number 1: 507-1073-6-ND
J4 = 2x1 Terminal Block: Made by: Andy Bates; Supplier 1: Digikey; Supplier Part Number 1: ED2740-ND
L1 = CB2518T151K: 150µH 210mA 4.6Ohm; Value: 150µH; Supplier 1: Digi-Key; Supplier Part Number 1: 587-3037-6-ND; Created By: Lyden Smith; Created On: 2017-06-05
L2 = NR4018T100M: 10uH 840mA; Created By: Lyden Smith; Created On: 2017-06-04; Value: 10µH; Supplier 1: Digi-Key; Supplier Part Number 1: 587-1664-1-ND
L3 = NR4018T6R8M: 6.8uH 1.06A; Supplier 1: Digi-Key; Created By: Lyden Smith; Created On: 2017-06-02; Supplier Part Number 1: 587-2657-1-ND; Value: 6.8µH
Q6 Q9 = BC846B,215: NPN 65V 100mA 250mW; Published: 8-Jun-2000; LatestRevisionDate: 09-Sep-2016; DatasheetVersion: 1997; Publisher: Andy Bates; Supplier 1: Digi-Key; Supplier Part Number 1: 568-1632-1-ND
Q8 = BC856A,215: PNP 65V 100mA 250mW; Published: 8-Jun-2000; LatestRevisionDate: 15-Jan-2003; Supplier 1: Digi-Key; Supplier Part Number 1: 568-4869-1-ND
R24 R26-R29 = 100kR, 1%, 1/10W, 0603 SMD: Made By: Andy Bates; Owned By: AUVic; Created On: 14-06-30; Last Edited: 14-06-30; Value: 100k; Supplier 1: Digi-Key; Supplier Part Number 1: 311-100KGRCT-ND
R25 = 10kR, 1%, 1/10W, 0603 SMD: Made By: Ashwin Sira; Owned By: AUVic; Created On: 14-05-31; Last Edited: 14-05-31; Supplier 1: Digi-Key; Supplier Part Number 1: 311-10.0KHRCT-ND; Value: 10k
R33 = 140kR, 1%, 1/16W, 0402, SMD: Created By: Lyden Smith; Publisher: AUVic; Date Created: 2017-09-22; Value: 140kR; Supplier 1: Digi-Key; Supplier Part Number 1: YAG2978CT-ND
R34 = 24k, 5%, 1/8W, 0805 SMD: Value: 24k; Created By: Lyden Smith; Created On: 2017-06-04; Supplier 1: Digi-Key; Supplier Part Number 1: RMCF0805JT24K0CT-ND
R35 = 510, 5%, 1/8W, 0805 SMD: Value: 510; Created By: Lyden Smith; Created On: 2017-06-04; Supplier 1: Digi-Key; Supplier Part Number 1: RMCF0805JT510RCT-ND
R36 = 7.5k, 5%, 1/8W, 0805 SMD: Value: 7.5k; Created By: Lyden Smith; Created On: 2017-06-04; Supplier 1: Digi-Key; Supplier Part Number 1: 311-7.5KARCT-ND
R39 = 680, 5%, 1/8W, 0805 SMD: Value: 680; Created By: Lyden Smith; Created On: 2017-06-04; Supplier 1: Digi-Key; Supplier Part Number 1: RMCF0805JT680RCT-ND
R40 = 3.9k, 5%, 1/8W, 0805 SMD: Value: 3.9k; Created By: Lyden Smith; Created On: 2017-06-04; Supplier 1: Digi-Key; Supplier Part Number 1: RMCF0805JT3K90CT-ND
R52 R53 = 20k, 1%, 1/10W, 0603, SMD: Created By: Andy Bates; Publisher: AUVic; Date Created: 2016-09-8; Value: 20kR; Supplier 1: Digi-Key; Supplier Part Number 1: 311-20.0KHRCT-ND
SW2 = DPDT, 12V, 200mA, SMT: Supplier 1: Digi-Key; Created By: Lyden Smith; Date Created: 2017-09-20
U12 = 3.3V TO-252 Linear Regulator: Supplier 1: Digi-Key; Supplier Part Number 1: LP2950ACDT-3.3RGOSCT-ND
U13 = RT6208GE: Adjustable Buck, 100mA, SOT-23; Supplier 1: Digi-Key; Created By: Lyden Smith; Created On: 2017-06-05
U14 U20 = BD9G101G-TR: DC-DC Regulator, 6V-42V in, 1V-29.4V out, 500mA; Supplier 1: Digi-Key
U15 = MC78M09CDTRKG: 9V Linear Regulator, 500mA; Supplier 1: Digi-Key; Supplier Part Number 1: MC78M09CDTRKGOSCT-ND; Created By: Lyden Smith; Created On: 2017-06-05
CN2 CN3 CN5 = 1x2, JST B2B-EH-A, Pads Pitch: 0.098" (2.50mm), Through Hole: Created By: Lyden Smith; Created On: 2018-01-27; Supplier 1: Digi-Key; Supplier 2: Digi-Key; Supplier Part Number 2: 455-1611-ND
CN4 = Header, Male, 2x2, Pitch: 0.1" (2.54mm), THT: Publisher: AUVic; Date Published: 2018-01-27; Last Updated: *; Reviewed By: *; Created By: Lyden Smith

## Sheet Reed_Switch_Input.SchDoc
size A4
Used 3 times, as channels RS1, RS2, RS3. Parts and nets are listed once, with the designators drawn on the sheet.
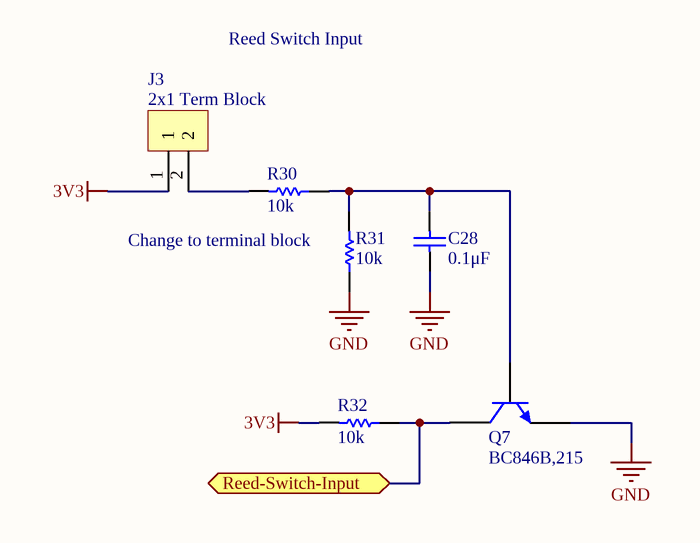
[diagram p4: Reed_Switch_Input.SchDoc]

### Parts
C28  0.1μF  [CAPC1608N(0603")]
J3  2x1 Term Block  [2X1 Terminal Blocks]
Q7  BC846B,215  [SOT-23]
R30  10k  [RESC1608N(0603")]
R31  10k  [RESC1608N(0603")]
R32  10k  [RESC1608N(0603")]

### Ports
Reed-Switch-Input

### Nets
3V3: J3.1 R32.2
GND: C28.1(Anode) Q7.2(E) R31.1
Reed-Switch-Input: Q7.3(C) R32.1 ; port Reed-Switch-Input
NetC28_2: C28.2(Cathode) Q7.1(B) R30.1 R31.2
NetJ3_2: J3.2 R30.2

### Channels
RS1: designators end in _RS1; ports Reed-Switch-Input=Reed-Switch-Input1
RS2: designators end in _RS2; ports Reed-Switch-Input=Reed-Switch-Input2
RS3: designators end in _RS3; ports Reed-Switch-Input=Reed-Switch-Input3

### Notes on the sheet
- Reed Switch Input
- (near R31) Change to terminal block

### Library data of the parts
C28 = 0.1uF 100V 0603 SMD, Ceramic: as C11 on sheet Micro; Published: 16-04-26; Publisher: AUVic; PackageDescription: Chip Capacitor; Value: 0.1μF; Created By: Ashwin Sira; Supplier 1: Digi-Key; Supplier Part Number 1: 445-6938-1-ND
J3 = 2x1 Terminal Block: Made by: Andy Bates; Supplier 1: Digikey; Supplier Part Number 1: ED2740-ND
Q7 = BC846B,215: NPN 65V 100mA 250mW; Published: 8-Jun-2000; LatestRevisionDate: 09-Sep-2016; DatasheetVersion: 1997; Publisher: Andy Bates; Supplier 1: Digi-Key; Supplier Part Number 1: 568-1632-1-ND
R30-R32 = 10kR, 1%, 1/10W, 0603 SMD: Made By: Ashwin Sira; Owned By: AUVic; Created On: 14-05-31; Last Edited: 14-05-31; Value: 10k; Supplier 1: Digi-Key; Supplier Part Number 1: 311-10.0KHRCT-ND

## Sheet USB_Interface.SchDoc
size A4
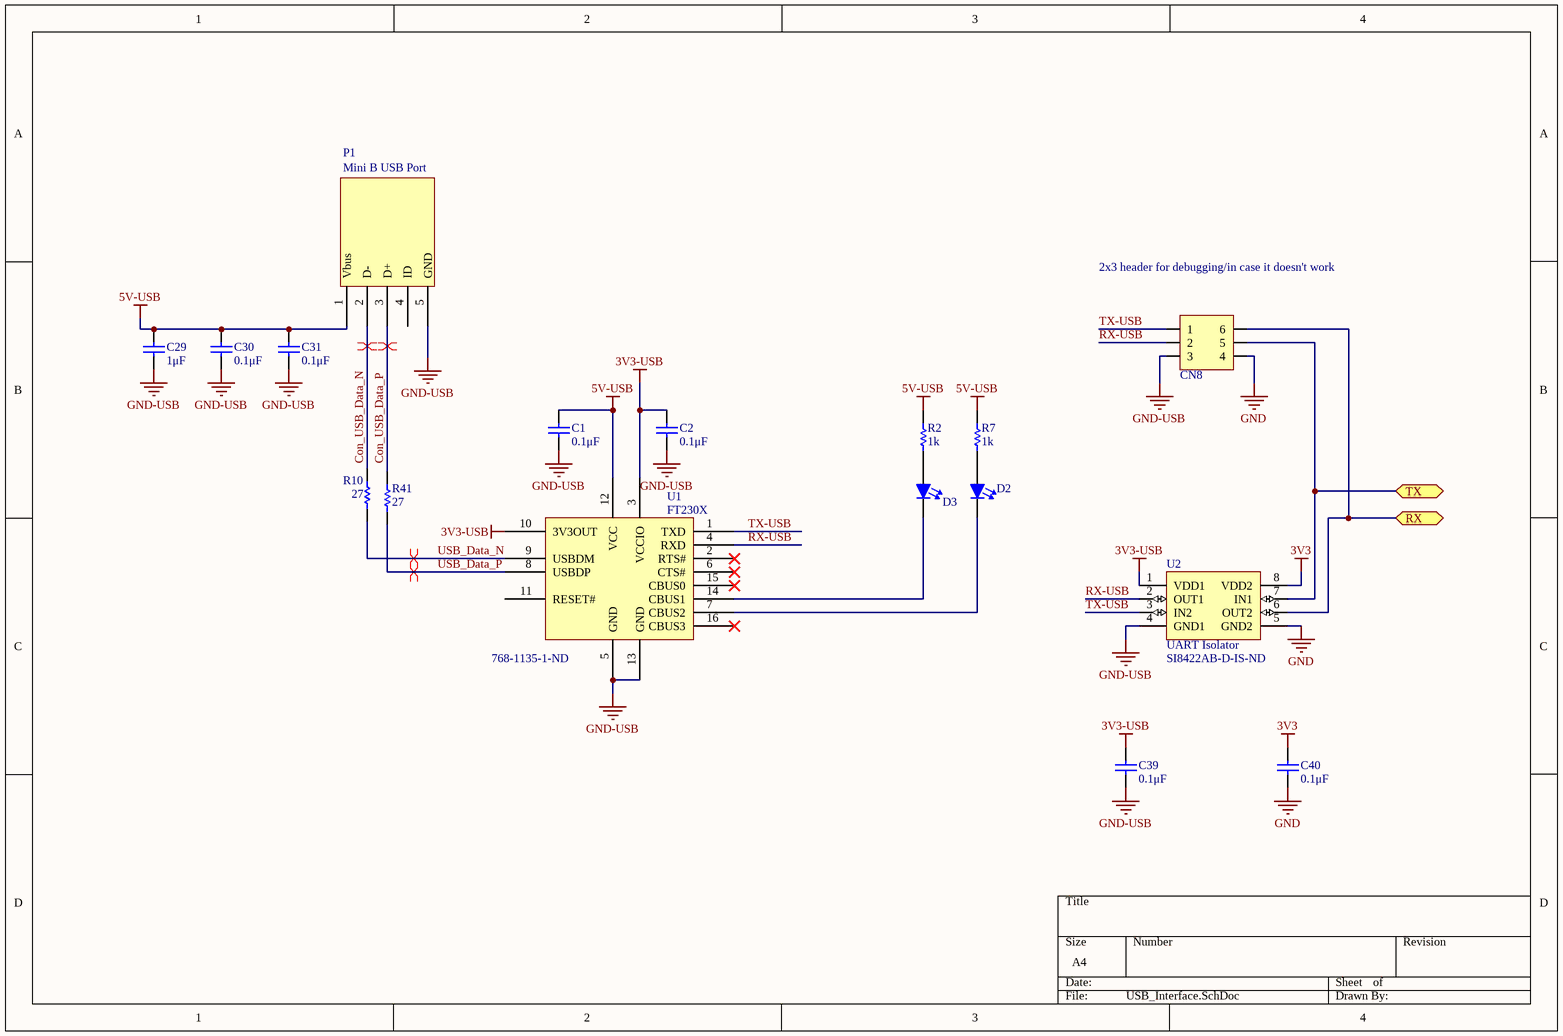
[diagram p5: USB_Interface.SchDoc]

### Parts
C1  0.1μF  [CAPC1608N(0603")]
C2  0.1μF  [CAPC1608N(0603")]
C29  1μF  [CAPC1608N(0603")]
C30  0.1μF  [CAPC1608N(0603")]
C31  0.1μF  [CAPC1608N(0603")]
C39  0.1μF  [CAPC1608N(0603")]
C40  0.1μF  [CAPC1608N(0603")]
CN8  Header, Male, 2x3, Pitch: 0.1" (2.54mm), THT  [Header, Male, 2x3, Pitch: 0.1" (2.54mm),THT]  (value not drawn)
D2  Red  [LED0805]  (value not drawn)
D3  Red  [LED0805]  (value not drawn)
P1  Mini B USB Port  [Mini B USB Footprint]
R2  1k  [RESC1608N(0603")]
R7  1k  [RESC1608N(0603")]
R10  27  [RESC1608N(0603")]
R41  27  [RESC1608N(0603")]
U1  FT230X  Supplier Part Number 1: 768-1135-1-ND  [SSOP16]
U2  UART Isolator  Supplier Part Number 1: SI8422AB-D-IS-ND  [SOIC-SN8_M]

### Ports
RX, TX

### Nets
3V3: C40.2(Cathode) U2.8(VDD2)
3V3-USB: C2.2(Cathode) C39.2(Cathode) U1.3(VCCIO) U1.10(3V3OUT) U2.1(VDD1)
5V-USB: C1.2(Cathode) C29.2(Cathode) C30.2(Cathode) C31.2(Cathode) P1.1(Vbus) R2.2 R7.2 U1.12(VCC)
GND: C40.1(Anode) CN8.4 U2.5(GND2)
GND-USB: C1.1(Anode) C2.1(Anode) C29.1(Anode) C30.1(Anode) C31.1(Anode) C39.1(Anode) CN8.3 P1.5(GND) U1.5(GND) U1.13(GND) U2.4(GND1)
Con_USB_Data_N: P1.2(D-) R10.1
Con_USB_Data_P: P1.3(D+) R41.1
RX-USB: CN8.2 U1.4(RXD) U2.2(OUT1)
TX-USB: CN8.1 U1.1(TXD) U2.3(IN2)
USB_Data_N: R10.2 U1.9(USBDM)
USB_Data_P: R41.2 U1.8(USBDP)
NetCN8_5: CN8.5 U2.7(IN1) ; port TX
NetCN8_6: CN8.6 U2.6(OUT2) ; port RX
NetD2_1: D2.1(Cathode) U1.7(CBUS2)
NetD2_2: D2.2(Anode) R7.1
NetD3_1: D3.1(Cathode) U1.14(CBUS1)
NetD3_2: D3.2(Anode) R2.1

Not connected (* = marked no-connect by the designer): P1 4(ID); U1 2(RTS#)* 6(CTS#)* 11(RESET#) 15(CBUS0)* 16(CBUS3)*

### Layout directives
differential pair: Con_USB_Data_N, Con_USB_Data_P, USB_Data_N, USB_Data_P

### Notes on the sheet
- 2x3 header for debugging/in case it doesn't work

### Library data of the parts
C1 C2 C30 C31 C39 C40 = 0.1uF 100V 0603 SMD, Ceramic: as C11 on sheet Micro; Published: 16-04-26; Publisher: AUVic; PackageDescription: Chip Capacitor; Value: 0.1μF; Created By: Ashwin Sira; Supplier 1: Digi-Key; Supplier Part Number 1: 445-6938-1-ND
C29 = 1uF 25V 0603 SMD, Ceramic: as C17 on sheet Micro; Published: 16-06-27; Publisher: AUVic; PackageDescription: Chip Capacitor; Value: 1μF; Created By: Andy Bates; Supplier 1: Digi-Key; Supplier Part Number 1: 490-3897-1-ND
D2 = LED, 0805 (2012), Green, Clear: Colour: Red; Created By: Andy Bates; Supplier 1: Digi-Key; Supplier Part Number 1: 475-1410-1-ND
D3 = LED, 0805 (2012), Red, Clear: Supplier 1: Digi-Key; Supplier Part Number 1: 732-4984-1-ND; Colour: Red; Created By: Ashwin Sira
P1 = Mini B USB Port: Mini B USB Port - Female; Created by: Gabriel Green; Created on: July 5, 2017; Supplier 1: Digi-Key; Supplier Part Number 1: 151-1206-1-ND
R2 R7 = 1kR, 1%, 1/10W , 0603, SMD: Created By: Andy Bates; Publisher: AUVic; Date Created: 2017-05-10; Value: 1k; Supplier 1: Digikey; Supplier Part Number 1: 311-1.00KHRCT-ND
R10 R41 = 27 Ohm, 1%, 1/10W , 0603, SMD: Created By: Andy Bates; Publisher: AUVic; Date Created: 2017-10-13; Value: 27; Supplier 1: Digi-Key; Supplier Part Number 1: 311-27.0HRCT-ND
U1 = FTDI - USB to UART: Supplier 1: Digi-Key; Created by: Gabriel Green; Created on: July 5th, 2017
U2 = UART Isolators 1Mbps 2.7-5.5V: UART Isolators 1/1 1Mbps; Made By: Andy Bates; Created On: 2017/09/10; Supplier 1: Digi-Key
CN8 = Header, Male, 2x3, Pitch: 0.1" (2.54mm), THT: Publisher: AUVic; Date Published: 2017-09-13; Last Updated: *; Reviewed By: *; Created By: Andy Bates

## Sheet Sensors.SchDoc
size A4
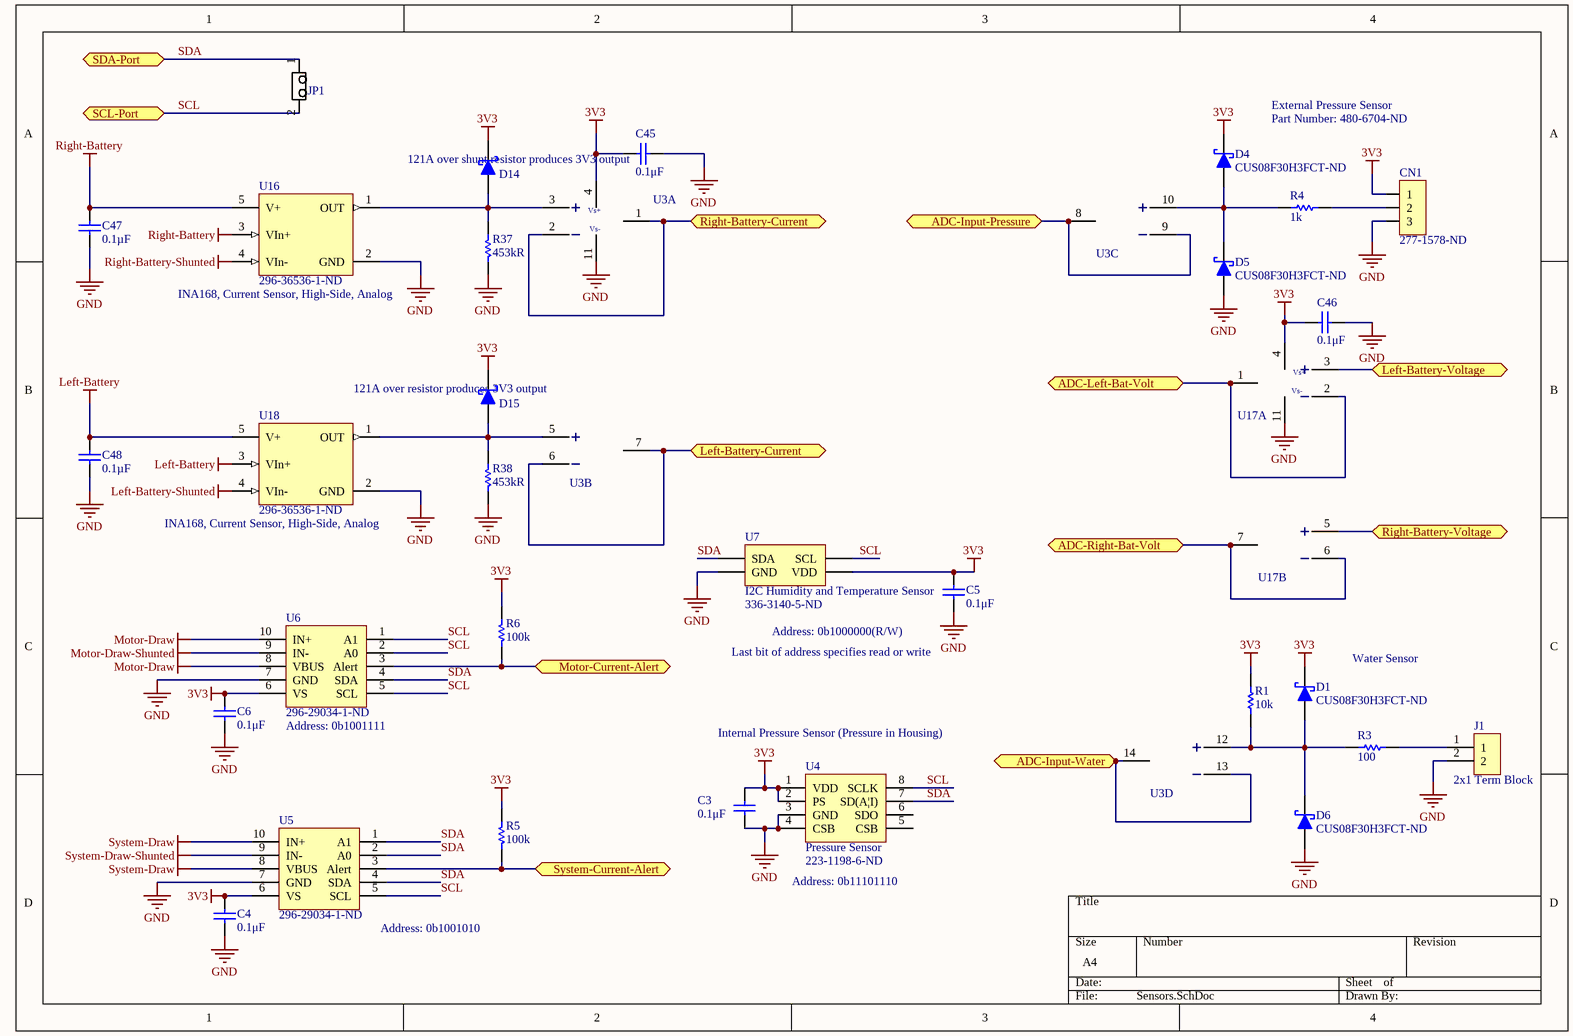
[diagram p6: Sensors.SchDoc]

### Parts
C3  0.1μF  [CAPC1608N(0603")]
C4  0.1μF  [CAPC1608N(0603")]
C5  0.1μF  [CAPC1608N(0603")]
C6  0.1μF  [CAPC1608N(0603")]
C45  0.1μF  [CAPC1608N(0603")]
C46  0.1μF  [CAPC1608N(0603")]
C47  0.1µF  [CAPC2012N(0805")]
C48  0.1µF  [CAPC2012N(0805")]
CN1  Supplier Part Number 1: 277-1578-ND  [3x1, Terminal Block, Pitch: 5mm, Screw, THT]  (hidden comment: 3x1, Terminal Block, Pitch: 5mm, Screw, THT)
D1  CUS08F30H3FCT-ND  [SC-76]
D4  CUS08F30H3FCT-ND  [SC-76]
D5  CUS08F30H3FCT-ND  [SC-76]
D6  CUS08F30H3FCT-ND  [SC-76]
D14  DB2J31400L  [SODFL250X80-2N]  (value not drawn)
D15  DB2J31400L  [SODFL250X80-2N]  (value not drawn)
J1  2x1 Term Block  [2X1 Terminal Blocks]
JP1  1X2 Pin Head  [2X1 Males Header]  (value not drawn)
R1  10k  [RESC1608N(0603")]
R3  100  [RESC1608N(0603")]
R4  1k  [RESC1608N(0603")]
R5  100k  [RESC2012N(0805")]
R6  100k  [RESC2012N(0805")]
R37  453kR  [RESC1608N(0603")]
R38  453kR  [RESC1608N(0603")]
U3  Quad Op Amp LMV324LIPT  [TSSOP14]  (value not drawn)  (parts A,B,C,D of 4)
U4  Pressure Sensor  Supplier Part Number 1: 223-1198-6-ND  [TE Pressure Sensor (MS560702BA03-50)]
U5  Supplier Part Number 2: 296-29034-1-ND  [MSOP-10]  (hidden comment: High side current sensor)
U6  Supplier Part Number 2: 296-29034-1-ND  [MSOP-10]  (hidden comment: High side current sensor)
U7  I2C Humidity and Temperature Sensor  Supplier Part Number 1: 336-3140-5-ND  [QFN-6]
U16  INA168, Current Sensor, High-Side, Analog  Supplier Part Number 1: 296-36536-1-ND  [SOT23-5]
U17  Quad Op Amp LMV324LIPT  [TSSOP14]  (value not drawn)  (parts A,B of 4)
U18  INA168, Current Sensor, High-Side, Analog  Supplier Part Number 1: 296-36536-1-ND  [SOT23-5]

### Ports
ADC-Input-Pressure, ADC-Input-Water, ADC-Left-Bat-Volt, ADC-Right-Bat-Volt, Left-Battery-Current, Left-Battery-Voltage, Motor-Current-Alert, Right-Battery-Current, Right-Battery-Voltage, SCL-Port, SDA-Port, System-Current-Alert

### Nets
3V3: C3.2(Cathode) C4.2(Cathode) C5.2(Cathode) C6.2(Cathode) C45.2(Cathode) C46.2(Cathode) CN1.1 D1.K(Cathode) D4.K(Cathode) D14.1(Cathode) D15.1(Cathode) R1.2 R5.2 R6.2 U3.4(Vcc+) U4.1(VDD) U4.2(PS) U5.6(VS) U6.6(VS) U7.5(VDD) U17.4(Vcc+)
GND: C3.1(Anode) C4.1(Anode) C5.1(Anode) C6.1(Anode) C45.1(Anode) C46.1(Anode) C47.1(Anode) C48.1(Anode) CN1.3 D5.A(Anode) D6.A(Anode) J1.2 R37.1 R38.1 U3.11(Vcc-) U4.3(GND) U4.4(CSB) U5.7(GND) U6.7(GND) U7.2(GND) U16.2(GND) U17.11(Vcc-) U18.2(GND)
Left-Battery: C48.2(Cathode) U18.3(VIn+) U18.5(V+)
Left-Battery-Shunted: U18.4(VIn-)
Motor-Draw: U6.8(VBUS) U6.10(IN+)
Motor-Draw-Shunted: U6.9(IN-)
Right-Battery: C47.2(Cathode) U16.3(VIn+) U16.5(V+)
Right-Battery-Shunted: U16.4(VIn-)
System-Draw: U5.8(VBUS) U5.10(IN+)
System-Draw-Shunted: U5.9(IN-)
SCL: JP1.2 U4.8(SCLK) U5.5(SCL) U6.1(A1) U6.2(A0) U6.5(SCL) U7.6(SCL) ; port SCL-Port
SDA: JP1.1 U4.7(SD(A|I)) U5.1(A1) U5.2(A0) U5.4(SDA) U6.4(SDA) U7.1(SDA) ; port SDA-Port
NetCN1_2: CN1.2 R4.2
NetD1_A: D1.A(Anode) D6.K(Cathode) R1.1 R3.1 U3.12(Non-Inverting_Input_4)
NetD4_A: D4.A(Anode) D5.K(Cathode) R4.1 U3.10(Non-Inverting_Input_3)
NetD14_2: D14.2(Anode) R37.2 U3.3(Non-Inverting_Input_1) U16.1(OUT)
NetD15_2: D15.2(Anode) R38.2 U3.5(Non-Inverting_Input_2) U18.1(OUT)
NetJ1_1: J1.1 R3.2
NetR5_1: R5.1 U5.3(Alert) ; port System-Current-Alert
NetR6_1: R6.1 U6.3(Alert) ; port Motor-Current-Alert
NetR54_2: U17.3(Non-Inverting_Input_1) ; port Left-Battery-Voltage
NetR55_2: U17.5(Non-Inverting_Input_2) ; port Right-Battery-Voltage
NetU3_1: U3.1(Output_1) U3.2(Inverting_Input_1) ; port Right-Battery-Current
NetU3_6: U3.6(Inverting_Input_2) U3.7(Output_2) ; port Left-Battery-Current
NetU3_8: U3.8(Output_3) U3.9(Inverting_Input_3) ; port ADC-Input-Pressure
NetU3_13: U3.13(Inverting_Input_3) U3.14(Output_4) ; port ADC-Input-Water
NetU11_16: U17.1(Output_1) U17.2(Inverting_Input_1) ; port ADC-Left-Bat-Volt
NetU11_17: U17.6(Inverting_Input_2) U17.7(Output_2) ; port ADC-Right-Bat-Volt

Not connected (* = marked no-connect by the designer): U4 5(CSB) 6(SDO)

### Notes on the sheet
- External Pressure Sensor
- 121A over shunt resistor produces 3V3 output
- Part Number: 480-6704-ND
- 121A over resistor produces 3V3 output
- Last bit of address specifies read or write
- Address: 0b1000000(R/W)
- Water Sensor
- (near U6) Address: 0b1001111
- Internal Pressure Sensor (Pressure in Housing)
- (near U4) Address: 0b11101110
- (near U5) Address: 0b1001010
- (in symbol Quad Op Amp LMV324LIPT, part A) Vs+; Vs-

### Library data of the parts
C3-C6 = 0.1uF 100V 0603 SMD, Ceramic: as C11 on sheet Micro; Published: 16-04-26; Publisher: AUVic; PackageDescription: Chip Capacitor; Value: 0.1μF; Created By: Ashwin Sira; Supplier 1: Digi-Key; Supplier Part Number 1: 445-6938-1-ND
C45 C46 = 0.1uF 16V 0603 SMD, Ceramic: Capacitor, Ceramic, 16V, +/- 10%, 0603 SMD, X7R; Published: 16-04-26; Publisher: AUVic; PackageDescription: Chip Capacitor; Value: 0.1μF; Created By: Andy Bates; Supplier 1: Digi-Key; Supplier Part Number 1: 1276-1005-1-ND
C47 C48 = 0.1uF 50V 0805 SMD, Ceramic: Capacitor, Ceramic, 50V, +/-5%, 0805 SMD, X7R; Published: 2016-03-16; Publisher: AUVic; PackageDescription: Chip Capacitor; Value: 0.1µF; Supplier 1: Digi-Key; Supplier Part Number 1: 1276-1090-1-ND
D1 D4-D6 = CUS08F30H3FCT-ND: Diode, Schottky, 30V, 800mA; Created By: Andy Bates; Publisher: AUVic; Date Created: 2016-09-09; Supplier 1: Digi-Key; Supplier Part Number 1: CUS08F30H3FCT-ND
D14 D15 = DB2J31400L: Diode, Schottky, 20V, 30mA; Created By: Ashwin Sira; Publisher: AUVic; Date Created: 2016-06-08; Supplier 1: Digi-Key; Supplier Part Number 1: DB2J31400LCT-ND
J1 = 2x1 Terminal Block: Made by: Andy Bates; Supplier 1: Digikey; Supplier Part Number 1: ED2740-ND
JP1 = 1x2 Male Header: Made By: Andy Bates; Supplier 1: Digikey; Supplier 1 Part Number: 952-3073-ND
R1 = 10kR, 1%, 1/10W, 0603 SMD: Made By: Ashwin Sira; Owned By: AUVic; Created On: 14-05-31; Last Edited: 14-05-31; Supplier 1: Digi-Key; Supplier Part Number 1: 311-10.0KHRCT-ND; Value: 10k
R3 = 100R, 1%, 1/10W, 0603 SMD: Made By: Andy Bates; Owned By: AUVic; Created On: 16-09-10; Last Edited: 16-09-10; Value: 100; Supplier 1: Digi-Key; Supplier Part Number 1: 311-100HRCT-ND
R4 = 1kR, 1%, 1/10W , 0603, SMD: Created By: Andy Bates; Publisher: AUVic; Date Created: 2017-05-10; Value: 1k; Supplier 1: Digikey; Supplier Part Number 1: 311-1.00KHRCT-ND
R5 R6 = 100kR, 1%, 1/4W, 0805 SMD: Made By: Ashwin Sira; Owned By: AUVic; Created On: 14-05-31; Last Edited: 14-05-31; Value: 100k; Supplier 1: Digi-Key; Supplier Part Number 1: 311-1.00MCRCT-ND
R37 R38 = 453kR, 1%, 1/10W, 0603 SMD_1: 453kR, 1%, 1/10W, 0603 SMD; Value: 453kR; Created By: Lyden Smith; Date Created: 2017-10-13; Supplier 1: Digi-Key; Supplier Part Number 1: 311-453KHRDKR-ND
U3 U17 = Quad Op Amp LMV324LIPT: LM324; Created By: Silvano; Creation Date: 05/10/2017; Supplier 1: Digi-Key; Supplier Part Number 1: 497-13053-1-ND
U4 = MS560702BA03-50 Pressure Sensor: 1kPa to 120 kPa; Made by: Andy Bates; Created on: 2017-09-11; Supplier 1: Digi-Key
U5 U6 = INA226AIDGSR, Current Sensor, High Side: 0-36V High side current sensor; Made by: Andy Bates; Created on: 2016-09-06; Supplier 1: Digikey; Supplier 1 Part number: 296-29034-1-ND; Supplier 2: Digi-Key
U7 = Si700XX: Made by: Andy Bates; Supplier 1: Digi-Key; Created on: 2019/09/08
CN1 = 3x1, Terminal Block, Pitch: 5mm, Screw, THT: Publisher: AUVic, Ashwin Sira; Date Published: 2014-06-03; Last Updated: *; Reviewed By: *; Supplier 1: Digi-Key
U16 U18 = INA168, Current Sensor, High-Side, Analog: Created By: Jacob Lower; Publisher: AUVic; Created On: 2016-03-16; Supplier 1: Digi-Key

## Nets that join several sheets
3V3: Micro (21 pins), Power (R28.2 R52.2 R53.2 U12.3), RS1 (J3_RS1.1 R32_RS1.2), RS2 (J3_RS2.1 R32_RS2.2), RS3 (J3_RS3.1 R32_RS3.2), USB_Interface (C40.2 U2.8), Sensors (21 pins)
5V-USB: Power (SW2.6), USB_Interface (8 pins)
GND: Micro (23 pins), Battery_Gate_Driver (30 pins), Power (29 pins), RS1 (C28_RS1.1 Q7_RS1.2 R31_RS1.1), RS2 (C28_RS2.1 Q7_RS2.2 R31_RS2.1), RS3 (C28_RS3.1 Q7_RS3.2 R31_RS3.1), USB_Interface (C40.1 CN8.4 U2.5), Sensors (23 pins)
GND-USB: Power (SW2.3), USB_Interface (11 pins)
Left-Battery: Battery_Gate_Driver (K1.30 R8.2), Sensors (C48.2 U18.3 U18.5)
Left-Battery-Shunted: Battery_Gate_Driver (7 pins), Sensors (U18.4)
Motor-Draw: Battery_Gate_Driver (5 pins), Sensors (U6.8 U6.10)
Motor-Draw-Shunted: Battery_Gate_Driver (Q3.5 Q5.5 R12.2), Sensors (U6.9)
Right-Battery: Battery_Gate_Driver (K2.30 R9.1), Sensors (C47.2 U16.3 U16.5)
Right-Battery-Shunted: Battery_Gate_Driver (9 pins), Sensors (U16.4)
System-Draw: Battery_Gate_Driver (F1.1 F2.1 R11.2), Sensors (U5.8 U5.10)
System-Draw-Shunted: Battery_Gate_Driver (Q4.5 R11.1), Power (J4.1 Q8.2), Sensors (U5.9)
System-Power: Battery_Gate_Driver (5 pins), Power (CN4.1 CN4.2)
NetCN8_5: Micro (U11.42), USB_Interface (CN8.5 U2.7)
NetCN8_6: Micro (U11.43), USB_Interface (CN8.6 U2.6)
NetQ9_3: Micro (U11.33), Power (Q9.3 R28.1)
NetR5_1: Micro (U11.23), Sensors (R5.1 U5.3)
NetR6_1: Micro (U11.22), Sensors (R6.1 U6.3)
NetR25_2: Micro (U11.41), Power (R25.2)
NetR52_1: Micro (U11.10), Power (R52.1 U20.4)
NetR53_1: Micro (U11.9), Power (R53.1 U14.4)
NetR54_2: Battery_Gate_Driver (R54.2 R56.1), Sensors (U17.3)
NetR55_2: Battery_Gate_Driver (R55.2 R57.1), Sensors (U17.5)
NetR60_1: Micro (U11.50), Battery_Gate_Driver (R60.1 U8.2)
NetR61_1: Micro (U11.45), Battery_Gate_Driver (R61.1 U10.2)
NetR62_1: Micro (U11.44), Battery_Gate_Driver (R62.1 U9.2)
NetU3_1: Micro (U11.20), Sensors (U3.1 U3.2)
NetU3_6: Micro (U11.21), Sensors (U3.6 U3.7)
NetU3_8: Micro (U11.15), Sensors (U3.8 U3.9)
NetU3_13: Micro (U11.14), Sensors (U3.13 U3.14)
NetU11_16: Micro (U11.16), Sensors (U17.1 U17.2)
NetU11_17: Micro (U11.17), Sensors (U17.6 U17.7)
Reed-Switch-Input1: Micro (U11.36), RS1 (Q7_RS1.3 R32_RS1.1)
Reed-Switch-Input2: Micro (U11.35), RS2 (Q7_RS2.3 R32_RS2.1)
Reed-Switch-Input3: Micro (U11.34), RS3 (Q7_RS3.3 R32_RS3.1)
SCL: Micro (R16.2 U11.58), Sensors (7 pins)
SDA: Micro (R15.2 U11.59), Sensors (7 pins)